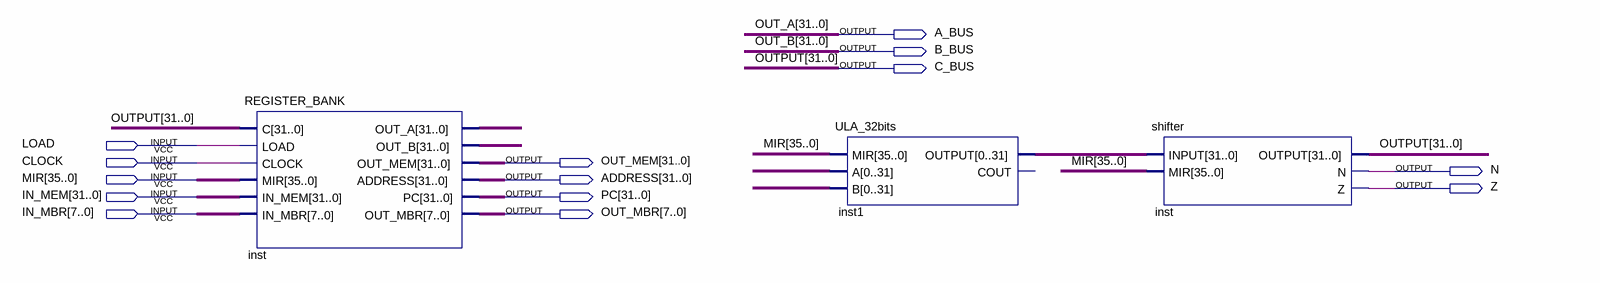
[diagram p0: schematic sheet]
// Quartus schematic DATAPATH.bdf as structural Verilog: 3 symbols, 14 pins
module DATAPATH (
  input  LOAD,
  input  CLOCK,
  input  [35:0] MIR,
  input  [31:0] IN_MEM,
  input  [7:0] IN_MBR,
  output A_BUS,
  output B_BUS,
  output C_BUS,
  output [31:0] OUT_MEM,
  output N,
  output [31:0] ADDRESS,
  output Z,
  output [31:0] PC,
  output [7:0] OUT_MBR
);

  wire [31:0] inst1_output, inst_out_a, inst_out_b, OUTPUT, undriven, undriven_2;

  REGISTER_BANK inst (
    .C(OUTPUT), .LOAD(LOAD), .CLOCK(CLOCK), .MIR(MIR), .IN_MEM(IN_MEM), .IN_MBR(IN_MBR), .OUT_A(inst_out_a),
    .OUT_B(inst_out_b), .OUT_MEM(OUT_MEM), .ADDRESS(ADDRESS), .PC(PC), .OUT_MBR(OUT_MBR));
  ULA_32bits inst1 (.MIR(MIR), .A(undriven), .B(undriven_2), .OUTPUT(inst1_output));  // open: COUT
  shifter inst_dup2 (.INPUT(inst1_output), .MIR(MIR), .OUTPUT(OUTPUT), .N(N), .Z(Z));
endmodule
